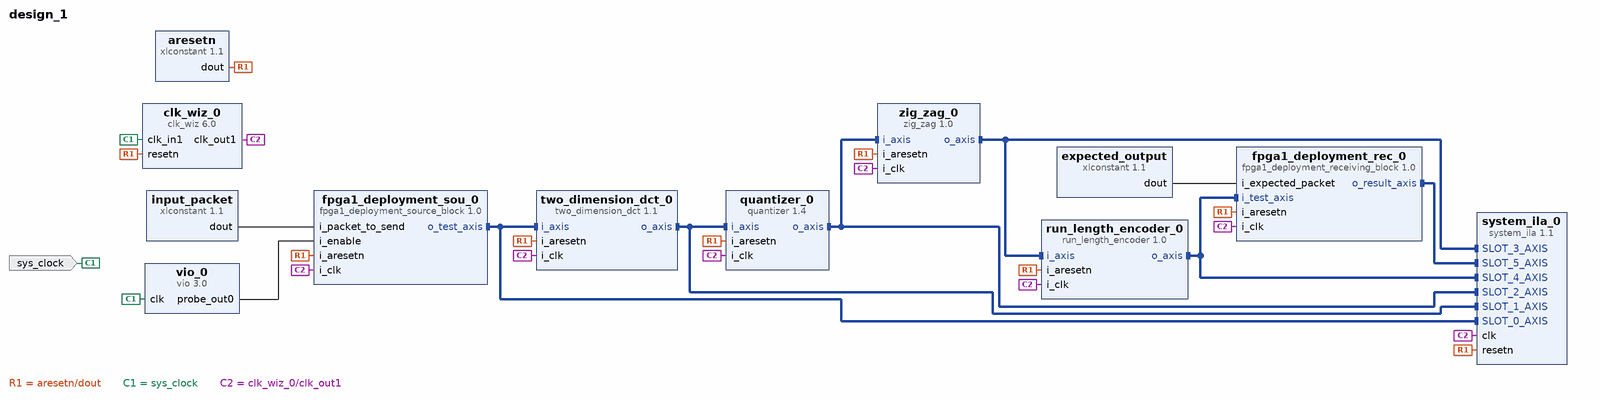
[diagram p0: block diagram of the top level]
# Vivado block design design_1, xc7a100tcsg324-1, Vivado 2018.3
create_bd_design design_1

create_bd_port -dir I -type clk sys_clock
set_property -dict {CONFIG.FREQ_HZ 100000000 CONFIG.PHASE 0.000} [get_bd_ports sys_clock]

create_bd_cell -type ip -vlnv user.org:user:fpga1_deployment_source_block:1.0 fpga1_deployment_sou_0
set_property -dict [list \
  CONFIG.AXIS_DATA_WIDTH 24 \
  CONFIG.NUM_BITS_PER_TRANSFER 17 \
  CONFIG.NUM_TRANSFERS 64 \
] [get_bd_cells fpga1_deployment_sou_0]
create_bd_cell -type ip -vlnv user.org:user:fpga1_deployment_receiving_block:1.0 fpga1_deployment_rec_0
set_property -dict [list \
  CONFIG.AXIS_DATA_WIDTH 16 \
  CONFIG.NUM_BITS_PER_TRANSFER 16 \
  CONFIG.NUM_TRANSFERS 6 \
] [get_bd_cells fpga1_deployment_rec_0]
create_bd_cell -type ip -vlnv xilinx.com:ip:xlconstant:1.1 input_packet
set_property -dict [list \
  CONFIG.CONST_VAL 0b00010000000000000000011111100000000000111110000000000001111010000000000011110000000000000111011000000000001110100000000000011100100000000000111000000000000001101110000000000011011000000000000110101000000000001101000000000000011001100000000000110010000000000001100010000000000011000000000000000101111000000000001011100000000000010110100000000000101100000000000001010110000000000010101000000000000101001000000000001010000000000000010011100000000000100110000000000001001010000000000010010000000000000100011000000000001000100000000000010000100000000000100000000000000000111110000000000001111000000000000011101000000000000111000000000000001101100000000000011010000000000000110010000000000001100000000000000010111000000000000101100000000000001010100000000000010100000000000000100110000000000001001000000000000010001000000000000100000000000000000111100000000000001110000000000000011010000000000000110000000000000001011000000000000010100000000000000100100000000000001000000000000000001110000000000000011000000000000000101000000000000001000000000000000001100000000000000010000000000000000010000000 \
  CONFIG.CONST_WIDTH 1088 \
] [get_bd_cells input_packet]
create_bd_cell -type ip -vlnv xilinx.com:ip:xlconstant:1.1 aresetn
create_bd_cell -type ip -vlnv xilinx.com:ip:xlconstant:1.1 expected_output
set_property -dict [list \
  CONFIG.CONST_VAL 0b111001000000000000000111111111110000110000000000000001111111111100000111111100110000010000010000 \
  CONFIG.CONST_WIDTH 96 \
] [get_bd_cells expected_output]
create_bd_cell -type ip -vlnv xilinx.com:ip:clk_wiz:6.0 clk_wiz_0
set_property -dict [list \
  CONFIG.CLKOUT1_JITTER 151.636 \
  CONFIG.CLKOUT1_REQUESTED_OUT_FREQ 50 \
  CONFIG.CLK_IN1_BOARD_INTERFACE sys_clock \
  CONFIG.MMCM_CLKOUT0_DIVIDE_F 20.000 \
  CONFIG.MMCM_DIVCLK_DIVIDE 1 \
  CONFIG.RESET_PORT resetn \
  CONFIG.RESET_TYPE ACTIVE_LOW \
  CONFIG.USE_BOARD_FLOW true \
  CONFIG.USE_LOCKED false \
] [get_bd_cells clk_wiz_0]
create_bd_cell -type ip -vlnv xilinx.com:ip:system_ila:1.1 system_ila_0
set_property -dict [list \
  CONFIG.C_NUM_MONITOR_SLOTS 6 \
  CONFIG.C_SLOT 5 \
  CONFIG.C_SLOT_0_INTF_TYPE xilinx.com:interface:axis_rtl:1.0 \
  CONFIG.C_SLOT_1_INTF_TYPE xilinx.com:interface:axis_rtl:1.0 \
  CONFIG.C_SLOT_2_INTF_TYPE xilinx.com:interface:axis_rtl:1.0 \
  CONFIG.C_SLOT_3_INTF_TYPE xilinx.com:interface:axis_rtl:1.0 \
  CONFIG.C_SLOT_4_INTF_TYPE xilinx.com:interface:axis_rtl:1.0 \
  CONFIG.C_SLOT_5_INTF_TYPE xilinx.com:interface:axis_rtl:1.0 \
] [get_bd_cells system_ila_0]
create_bd_cell -type ip -vlnv xilinx.com:ip:vio:3.0 vio_0
set_property -dict {CONFIG.C_NUM_PROBE_IN 0} [get_bd_cells vio_0]
create_bd_cell -type ip -vlnv user.org:user:zig_zag:1.0 zig_zag_0
create_bd_cell -type ip -vlnv user.org:user:run_length_encoder:1.0 run_length_encoder_0
create_bd_cell -type ip -vlnv user.org:user:quantizer:1.4 quantizer_0
create_bd_cell -type ip -vlnv user.org:user:two_dimension_dct:1.1 two_dimension_dct_0

# ---- connections ----

connect_bd_intf_net [get_bd_intf_pins zig_zag_0/o_axis] [get_bd_intf_pins run_length_encoder_0/i_axis]
connect_bd_intf_net [get_bd_intf_pins zig_zag_0/o_axis] [get_bd_intf_pins system_ila_0/SLOT_3_AXIS]
connect_bd_intf_net [get_bd_intf_pins quantizer_0/o_axis] [get_bd_intf_pins zig_zag_0/i_axis]
connect_bd_intf_net [get_bd_intf_pins quantizer_0/o_axis] [get_bd_intf_pins system_ila_0/SLOT_2_AXIS]
connect_bd_intf_net [get_bd_intf_pins fpga1_deployment_rec_0/o_result_axis] [get_bd_intf_pins system_ila_0/SLOT_5_AXIS]
connect_bd_intf_net [get_bd_intf_pins two_dimension_dct_0/o_axis] [get_bd_intf_pins quantizer_0/i_axis]
connect_bd_intf_net [get_bd_intf_pins two_dimension_dct_0/o_axis] [get_bd_intf_pins system_ila_0/SLOT_1_AXIS]
connect_bd_intf_net [get_bd_intf_pins fpga1_deployment_sou_0/o_test_axis] [get_bd_intf_pins two_dimension_dct_0/i_axis]
connect_bd_intf_net [get_bd_intf_pins fpga1_deployment_sou_0/o_test_axis] [get_bd_intf_pins system_ila_0/SLOT_0_AXIS]
connect_bd_intf_net -intf_net one_dimension_dct_0_o_axis [get_bd_intf_pins run_length_encoder_0/o_axis] [get_bd_intf_pins fpga1_deployment_rec_0/i_test_axis]
connect_bd_intf_net [get_bd_intf_pins run_length_encoder_0/o_axis] [get_bd_intf_pins system_ila_0/SLOT_4_AXIS]
connect_bd_net [get_bd_pins aresetn/dout] \
  [get_bd_pins fpga1_deployment_sou_0/i_aresetn] [get_bd_pins fpga1_deployment_rec_0/i_aresetn] \
  [get_bd_pins clk_wiz_0/resetn] [get_bd_pins system_ila_0/resetn] [get_bd_pins zig_zag_0/i_aresetn] \
  [get_bd_pins run_length_encoder_0/i_aresetn] [get_bd_pins quantizer_0/i_aresetn] \
  [get_bd_pins two_dimension_dct_0/i_aresetn]
connect_bd_net [get_bd_pins expected_output/dout] [get_bd_pins fpga1_deployment_rec_0/i_expected_packet]
connect_bd_net [get_bd_pins input_packet/dout] [get_bd_pins fpga1_deployment_sou_0/i_packet_to_send]
connect_bd_net [get_bd_ports sys_clock] [get_bd_pins clk_wiz_0/clk_in1] [get_bd_pins vio_0/clk]
connect_bd_net [get_bd_pins clk_wiz_0/clk_out1] \
  [get_bd_pins fpga1_deployment_sou_0/i_clk] [get_bd_pins fpga1_deployment_rec_0/i_clk] [get_bd_pins system_ila_0/clk] \
  [get_bd_pins zig_zag_0/i_clk] [get_bd_pins run_length_encoder_0/i_clk] [get_bd_pins quantizer_0/i_clk] \
  [get_bd_pins two_dimension_dct_0/i_clk]
connect_bd_net [get_bd_pins vio_0/probe_out0] [get_bd_pins fpga1_deployment_sou_0/i_enable]

validate_bd_design
save_bd_design
